# EAGLE schematic OpenDoorController (EAGLE 6.2)
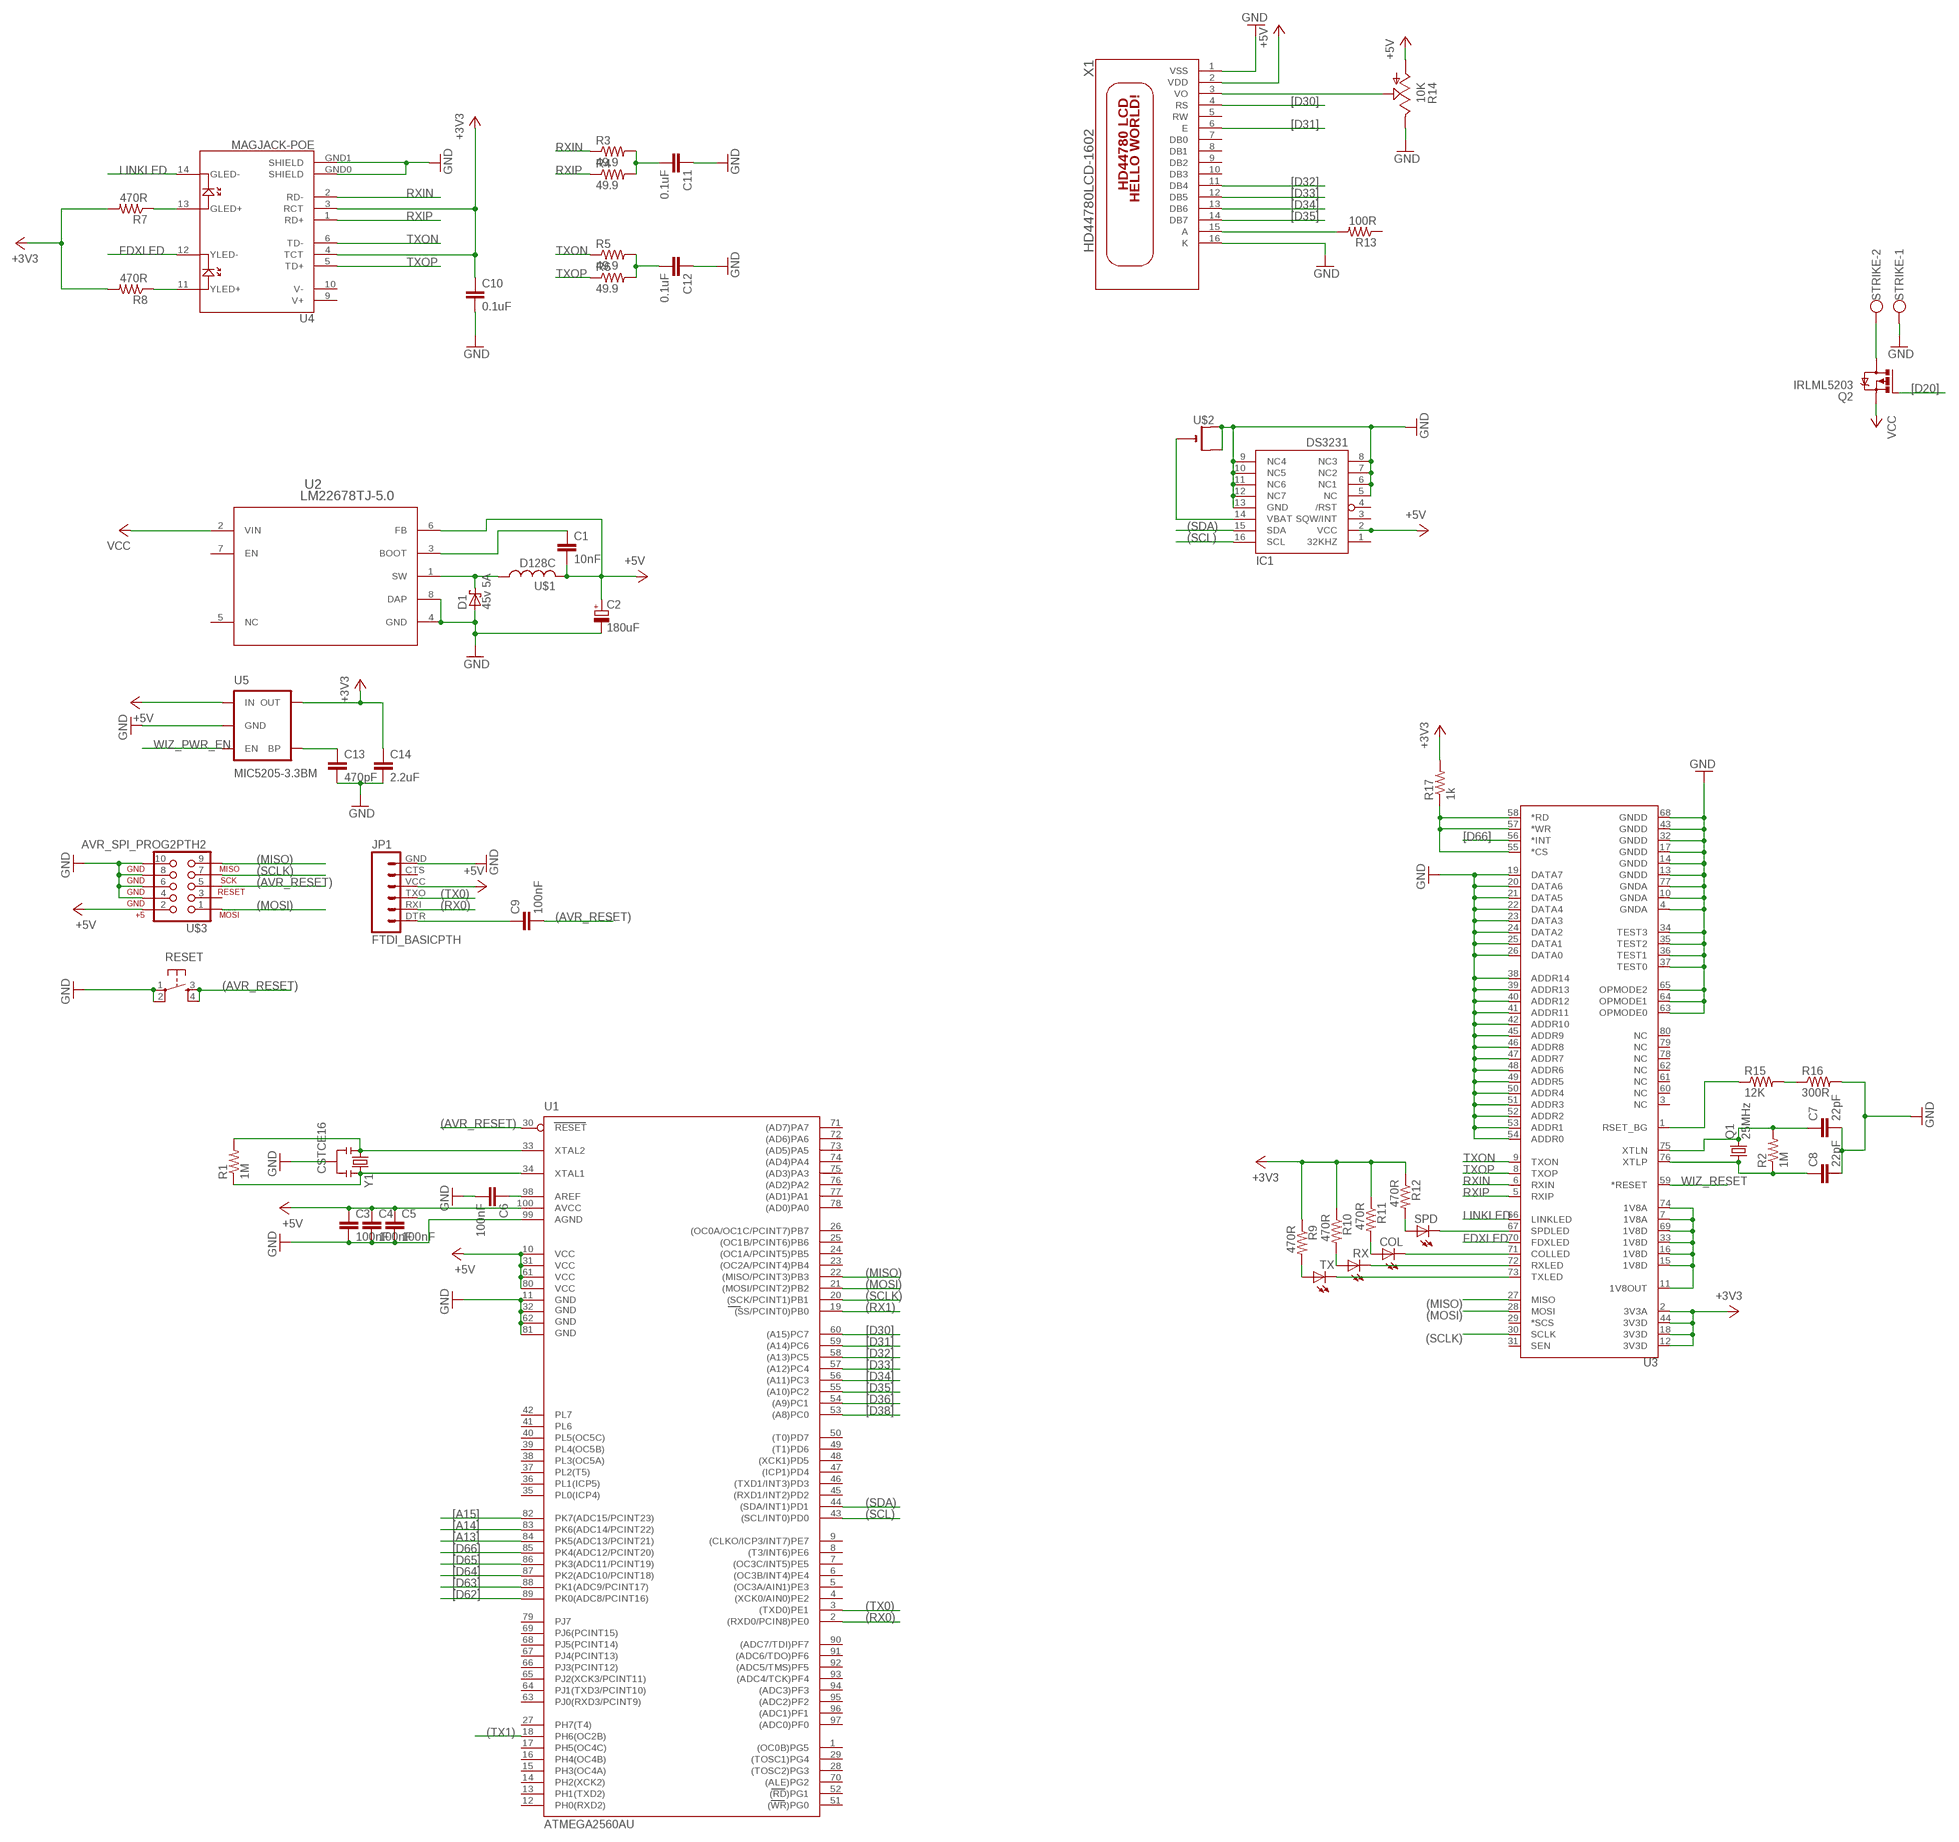
[diagram p0: schematic, sheet 1]

## Parts
C1  10nF  C-EUC1206  [C1206]
C2  180uF  CPOL-EU153CLV-0810  [153CLV-0810]
C3  100nF  C-EUC0805  [C0805]
C4  100nF  C-EUC0805  [C0805]
C5  100nF  C-EUC0805  [C0805]
C6  100nF  C-EUC0805  [C0805]
C7  22pF  C-EUC0805  [C0805]
C8  22pF  C-EUC0805  [C0805]
C9  100nF  C-EUC0805  [C0805]
C10  0.1uF  C-EUC0805  [C0805]
C11  0.1uF  C-EUC0805  [C0805]
C12  0.1uF  C-EUC0805  [C0805]
C13  470pF  C-EUC0805  [C0805]
C14  2.2uF  C-EUC0805  [C0805]
COL  LEDCHIPLED_0805  [CHIPLED_0805]
D1  45v 5A  SCHOTTKY-DIODESMC  [SMC]
IC1  DS3231/SO  [SO16W]
JP1  FTDI_BASICPTH  [FTDI_BASIC]
Q1  25MHz  CRYSTALSM49  [SM49]
Q2  IRLML5203  [MICRO3]
R1  1M  R-US_M1206  [M1206]
R2  1M  R-US_M1206  [M1206]
R3  49.9  R-US_M0805  [M0805]
R4  49.9  R-US_M0805  [M0805]
R5  49.9  R-US_M0805  [M0805]
R6  49.9  R-US_M0805  [M0805]
R7  470R  R-US_M0805  [M0805]
R8  470R  R-US_M0805  [M0805]
R9  470R  R-US_M0805  [M0805]
R10  470R  R-US_M0805  [M0805]
R11  470R  R-US_M0805  [M0805]
R12  470R  R-US_M0805  [M0805]
R13  100R  R-US_M0805  [M0805]
R14  10K  TRIM_US-SM-42/43W  [SM-42/43W]
R15  12K  R-US_M0805  [M0805]
R16  300R  R-US_M0805  [M0805]
R17  1k  R-US_M0805  [M0805]
RESET  TAC_SWITCHSMD  [TACTILE_SWITCH_SMD]
RX  LEDCHIPLED_0805  [CHIPLED_0805]
SPD  LEDCHIPLED_0805  [CHIPLED_0805]
STRIKE  W237-102  [W237-102]
TX  LEDCHIPLED_0805  [CHIPLED_0805]
U1  ATMEGA2560AU  [TQFP100]
U2  LM22678TJ-5.0  [TJ7A]
U3  W5100  [LQFP-80]
U4  MAGJACK-POE  [MAGJACK-POE]
U5  MIC5205-3.3BM  V_REG_LDOSMD  [SOT23-5]
U$1  D128C  [D128C]
U$2  CR2032SMT  [CR2032-SMD]
U$3  AVR_SPI_PROG2PTH2  [2X5-SHROUDED]
X1  HD44780LCD-1602  [LCD1602]
Y1  CSTCE16  RESONATORSMD  [RESONATOR-SMD]

## Nets
(AVR_RESET): C9.2 RESET.3 RESET.4 U1.30(RESET) U$3.5
(MISO): U1.22((MISO/PCINT3)PB3) U3.27(MISO) U$3.9
(MOSI): U1.21((MOSI/PCINT2)PB2) U3.28(MOSI) U$3.1
(RX0): JP1.RXI U1.2((RXD0/PCIN8)PE0)
(RX1): U1.19((SS/PCINT0)PB0)
(SCL): IC1.16(SCL) U1.43((SCL/INT0)PD0)
(SCLK): U1.20((SCK/PCINT1)PB1) U3.30(SCLK) U$3.7
(SDA): IC1.15(SDA) U1.44((SDA/INT1)PD1)
(TX0): JP1.TXO U1.3((TXD0)PE1)
(TX1): U1.18(PH6(OC2B))
+3V3: C10.1 C14.1 R7.2 R8.2 R9.1 R10.1 R11.1 R12.1 R17.2 U3.2(3V3A) U3.12(3V3D) U3.18(3V3D) U3.44(3V3D) U4.4(TCT) U5.5(OUT)
+5V: C1.2 C2.+ C3.1 C4.1 C5.1 IC1.2(VCC) JP1.VCC R14.1(A) U1.10(VCC) U1.31(VCC1) U1.61(VCC2) U1.80(VCC3) U1.100(AVCC) U2.6(FB) U5.1(IN) U$1.P$2 U$3.2 X1.2(VDD)
[A13]: U1.84(PK5(ADC13/PCINT21))
[A14]: U1.83(PK6(ADC14/PCINT22))
[A15]: U1.82(PK7(ADC15/PCINT23))
[D30]: U1.60((A15)PC7) X1.4(RS)
[D31]: U1.59((A14)PC6) X1.6(E)
[D32]: U1.58((A13)PC5) X1.11(DB4)
[D33]: U1.57((A12)PC4) X1.12(DB5)
[D34]: U1.56((A11)PC3) X1.13(DB6)
[D35]: U1.55((A10)PC2) X1.14(DB7)
[D36]: U1.54((A9)PC1)
[D38]: U1.53((A8)PC0)
[D62]: U1.89(PK0(ADC8/PCINT16))
[D63]: U1.88(PK1(ADC9/PCINT17))
[D64]: U1.87(PK2(ADC10/PCINT18))
[D65]: U1.86(PK3(ADC11/PCINT19))
[D66]: U1.85(PK4(ADC12/PCINT20)) U3.56(*INT)
FDXLED: U3.70(FDXLED) U4.12(YLED-)
GND: C2.- C3.2 C4.2 C5.2 C6.2 C7.2 C8.2 C10.2 C11.1 C12.1 C13.2 C14.2 D1.A IC1.5(NC) IC1.6(NC1) IC1.7(NC2) IC1.8(NC3) IC1.9(NC4) IC1.10(NC5) IC1.11(NC6) IC1.12(NC7) IC1.13(GND) JP1.GND R14.3(E) R16.2 RESET.1 RESET.2 STRIKE.1 U1.11(GND) U1.32(GND1) U1.62(GND2) U1.81(GND3) U1.99(AGND) U2.4(GND) U2.8(DAP) U3.4(GNDA) U3.10(GNDA) U3.13(GNDD) U3.14(GNDD) U3.17(GNDD) U3.19(DATA7) U3.20(DATA6) U3.21(DATA5) U3.22(DATA4) U3.23(DATA3) U3.24(DATA2) U3.25(DATA1) U3.26(DATA0) U3.32(GNDD) U3.34(TEST3) U3.35(TEST2) U3.36(TEST1) U3.37(TEST0) U3.38(ADDR14) U3.39(ADDR13) U3.40(ADDR12) U3.41(ADDR11) U3.42(ADDR10) U3.43(GNDD) U3.45(ADDR9) U3.46(ADDR8) U3.47(ADDR7) U3.48(ADDR6) U3.49(ADDR5) U3.50(ADDR4) U3.51(ADDR3) U3.52(ADDR2) U3.53(ADDR1) U3.54(ADDR0) U3.63(OPMODE0) U3.64(OPMODE1) U3.65(OPMODE2) U3.68(GNDD) U3.77(GNDA) U4.GND0(SHIELD) U4.GND1(SHIELD) U5.2(GND) U$2.+$1(+) U$2.+$2(+1) U$3.4 U$3.6 U$3.8 U$3.10 X1.1(VSS) X1.16(K) Y1.2
LINKLED: U3.66(LINKLED) U4.14(GLED-)
N$1: D1.C U2.1(SW) U$1.P$1
N$2: C1.1 U2.3(BOOT)
N$3: R1.1 U1.34(XTAL1) Y1.3
N$4: R1.2 U1.33(XTAL2) Y1.1
N$5: U3.7(1V8A) U3.11(1V8OUT) U3.15(1V8D) U3.16(1V8D) U3.33(1V8D) U3.69(1V8D) U3.74(1V8A)
N$6: C6.1 U1.98(AREF)
N$7: Q2.3(D) STRIKE.2
N$8: C7.1 Q1.2 R2.2 U3.75(XTLN)
N$9: C9.1 JP1.DTR
N$10: IC1.14(VBAT) U$2.-
N$11: C8.1 Q1.1 R2.1 U3.76(XTLP)
N$12: C12.2 R5.2 R6.2
N$13: R8.1 U4.11(YLED+)
N$14: C11.2 R3.2 R4.2
N$15: R7.1 U4.13(GLED+)
N$16: R9.2 TX.A
N$17: R10.2 RX.A
N$18: COL.A R11.2
N$19: R12.2 SPD.A
N$20: SPD.C U3.67(SPDLED)
N$21: COL.C U3.71(COLLED)
N$22: RX.C U3.72(RXLED)
N$23: TX.C U3.73(TXLED)
N$24: R14.2(S) X1.3(VO)
N$25: R13.2 X1.15(A)
N$26: R15.1 U3.1(RSET_BG)
N$27: R15.2 R16.1
N$28: R17.1 U3.55(*CS) U3.57(*WR) U3.58(*RD)
N$29: C13.1 U5.4(BP)
RXIN: R3.1 U3.6(RXIN)
RXIP: R4.1 U3.5(RXIP)
TXON: R5.1 U3.9(TXON) U4.6(TD-)
TXOP: R6.1 U3.8(TXOP) U4.5(TD+)
VCC: Q2.2(S) U2.2(VIN)
WIZ_PWR_EN: U5.3(EN)
WIZ_RESET: U3.59(*RESET)
Unconnected: IC1.1(32KHZ) IC1.3(SQW/INT) IC1.4(/RST) JP1.CTS Q2.1(G) R13.1 U1.1((OC0B)PG5) U1.4((XCK0/AIN0)PE2) U1.5((OC3A/AIN1)PE3) U1.6((OC3B/INT4)PE4) U1.7((OC3C/INT5)PE5) U1.8((T3/INT6)PE6) U1.9((CLKO/ICP3/INT7)PE7) U1.12(PH0(RXD2)) U1.13(PH1(TXD2)) U1.14(PH2(XCK2)) U1.15(PH3(OC4A)) U1.16(PH4(OC4B)) U1.17(PH5(OC4C)) U1.23((OC2A/PCINT4)PB4) U1.24((OC1A/PCINT5)PB5) U1.25((OC1B/PCINT6)PB6) U1.26((OC0A/OC1C/PCINT7)PB7) U1.27(PH7(T4)) U1.28((TOSC2)PG3) U1.29((TOSC1)PG4) U1.35(PL0(ICP4)) U1.36(PL1(ICP5)) U1.37(PL2(T5)) U1.38(PL3(OC5A)) U1.39(PL4(OC5B)) U1.40(PL5(OC5C)) U1.41(PL6) U1.42(PL7) U1.45((RXD1/INT2)PD2) U1.46((TXD1/INT3)PD3) U1.47((ICP1)PD4) U1.48((XCK1)PD5) U1.49((T1)PD6) U1.50((T0)PD7) U1.51((WR)PG0) U1.52((RD)PG1) U1.63(PJ0(RXD3/PCINT9)) U1.64(PJ1(TXD3/PCINT10)) U1.65(PJ2(XCK3/PCINT11)) U1.66(PJ3(PCINT12)) U1.67(PJ4(PCINT13)) U1.68(PJ5(PCINT14)) U1.69(PJ6(PCINT15)) U1.70((ALE)PG2) U1.71((AD7)PA7) U1.72((AD6)PA6) U1.73((AD5)PA5) U1.74((AD4)PA4) U1.75((AD3)PA3) U1.76((AD2)PA2) U1.77((AD1)PA1) U1.78((AD0)PA0) U1.79(PJ7) U1.90((ADC7/TDI)PF7) U1.91((ADC6/TDO)PF6) U1.92((ADC5/TMS)PF5) U1.93((ADC4/TCK)PF4) U1.94((ADC3)PF3) U1.95((ADC2)PF2) U1.96((ADC1)PF1) U1.97((ADC0)PF0) U2.5(NC) U2.7(EN) U3.3(NC) U3.29(*SCS) U3.31(SEN) U3.60(NC) U3.61(NC) U3.62(NC) U3.78(NC) U3.79(NC) U3.80(NC) U4.1(RD+) U4.2(RD-) U4.3(RCT) U4.9(V+) U4.10(V-) U$3.3 X1.5(RW) X1.7(DB0) X1.8(DB1) X1.9(DB2) X1.10(DB3)

## Library data of the parts
C1 C3-C14 = rcl:C-EU: CAPACITOR, European symbol
C2 = rcl:CPOL-EU: POLARIZED CAPACITOR, European symbol
COL RX SPD TX = led:LED: LED OSRAM: - CHIPLED LG R971, LG N971, LY N971, LG Q971, LY Q971, LO R971, LY R971 LH N974, LH R974 LS Q976, LO Q976, LY Q976 LO Q996 - Hyper CHIPLED LW Q18S LB Q993, LB Q99A, LB R99A - SideLED LS A670, LO A670, LY A670, LG A670, LP A670 LB A673, LV A673, LT A673, LW A673 LH A674 LY A675 LS A676, LA A676, LO A676, LY A676, LW A676 LS A679, LY A679, LG A679 - Hyper Micro SIDELED® LS Y876, LA Y876, LO Y876, LY Y876 LT Y87S - SmartLED LW L88C, LW L88S LB L89C, LB L89S, LG L890 LS L89K, LO L89K, LY L89K LS L896, LA L896, LO L896, LY L896 - TOPLED LS T670, LO T670, LY T670, LG T670, LP T670 LSG T670, LSP T670, LSY T670, LOP T670, LYG T670 LG T671, LOG T671, LSG T671 LB T673, LV T673, LT T673, LW T673 LH T674 LS T676, LA T676, LO T676, LY T676, LB T676, LH T676, LSB T676, LW T676 LB T67C, LV T67C, LT T67C, LS T67K, LO T67K, LY T67K, LW E67C LS E67B, LA E67B, LO E67B, LY E67B, LB E67C, LV E67C, LT E67C LW T67C LS T679, LY T679, LG T679 LS T770, LO T770, LY T770, LG T770, LP T770 LB T773, LV T773, LT T773, LW T773 LH T774 LS E675, LA E675, LY E675, LS T675 LS T776, LA T776, LO T776, LY T776, LB T776 LHGB T686 LT T68C, LB T68C - Hyper Mini TOPLED® LB M676 - Mini TOPLED Santana® LG M470 LS M47K, LO M47K, LY M47K Source: http://www.osram.convergy.de LUXEON: - LUMILED® LXK2-PW12-R00, LXK2-PW12-S00, LXK2-PW14-U00, LXK2-PW14-V00 LXK2-PM12-R00, LXK2-PM12-S00, LXK2-PM14-U00 LXK2-PE12-Q00, LXK2-PE12-R00, LXK2-PE12-S00, LXK2-PE14-T00, LXK2-PE14-U00 LXK2-PB12-K00, LXK2-PB12-L00, LXK2-PB12-M00, LXK2-PB14-N00, LXK2-PB14-P00, LXK2-PB14-Q00 LXK2-PR12-L00, LXK2-PR12-M00, LXK2-PR14-Q00, LXK2-PR14-R00 LXK2-PD12-Q00, LXK2-PD12-R00, LXK2-PD12-S00 LXK2-PH12-R00, LXK2-PH12-S00 LXK2-PL12-P00, LXK2-PL12-Q00, LXK2-PL12-R00 Source: www.luxeon.com KINGBRIGHT: KA-3528ASYC Source: www.kingbright.com
D1 = diode:SCHOTTKY-DIODE: Schottky Diode
IC1 = adafruit:DS3231
JP1 = SparkFun:FTDI_BASIC: FTDI Basic: 3.3V and 5V
Q1 = crystal:CRYSTAL: CRYSTAL; OC_FARNELL: unknown; OC_NEWARK: unknown
Q2 = transistor-power:IRLML5203: HEXFET P-Channel Power MOSFET
R1-R13 R15-R17 = rcl:R-US_: RESISTOR, American symbol
R14 = pot:TRIM_US-: POTENTIOMETER
RESET = SparkFun:TAC_SWITCH: Momentary Switch Button commonly used for reset or general input. Spark Fun Electronics SKU : COM-00097
STRIKE = con-wago-500:W237-102: WAGO SCREW CLAMP; MPN: 237-102; OC_FARNELL: unknown; OC_NEWARK: 70K9898
U1 = SparkFun:ATMEGA2560: MICROCONTROLLER 64/128/256 Kbytes FLASH 4 Kbytes EEPROM 8 Kbytes SRAM 86 General Purpose I/O pins 12-channels16-bit PWM 4 x Serial USARTs 16-channels 10-bit A/D
U2 = CustomSymbols:LM22678TJ-5.0
U3 = SparkFun:W5100: WIZnet W5100 TCP/IP PHY Embedded Chip See SparkFun catalog # COM-09471 Package: LQFP-80,10x10mm, 0.4mm pitch
U4 = SparkFun:MAGJACK-POE: PoE compatible MagJack
U5 = SparkFun:V_REG_LDO: Voltage Regulator LDO Standard 150mA LDO voltage regulator in SOT-23 layout. Micrel part MIC5205. BP (by-pass) pin is used to lower output noise with 470pF cap.
U$1 = CustomSymbols:D128C; STOCKNUM: 724-4890; SUPPLIER: RS Components
U$2 = adafruit:CR2032
U$3 = SparkFun:AVR_SPI_PROG2: AVR ICSP Header This is the standard AVR In Circuit Serial Programming header. Minimal, but includes pin one indicator. Works with standard Olimex programmers. Also look for the 6-pin reduced version. Spark Fun Electronics SKU: PRT-00778
X1 = adafruit:HD44780LCD: HD44780 LCD Standard character type LCDs, available in sizes from 8x1 to 40x4!
Y1 = SparkFun:RESONATOR: Resonator Small SMD resonator. This is the itty bitty 10/20MHz resonators with built in caps. CSTCE10M0G55 and CSTCE20M0V53. Footprint has been reviewed closely but hasn't been tested yet.